# EAGLE design gps_tracker_mark3 (EAGLE 7.4.0)

## Sheet 1 of 2: Flight
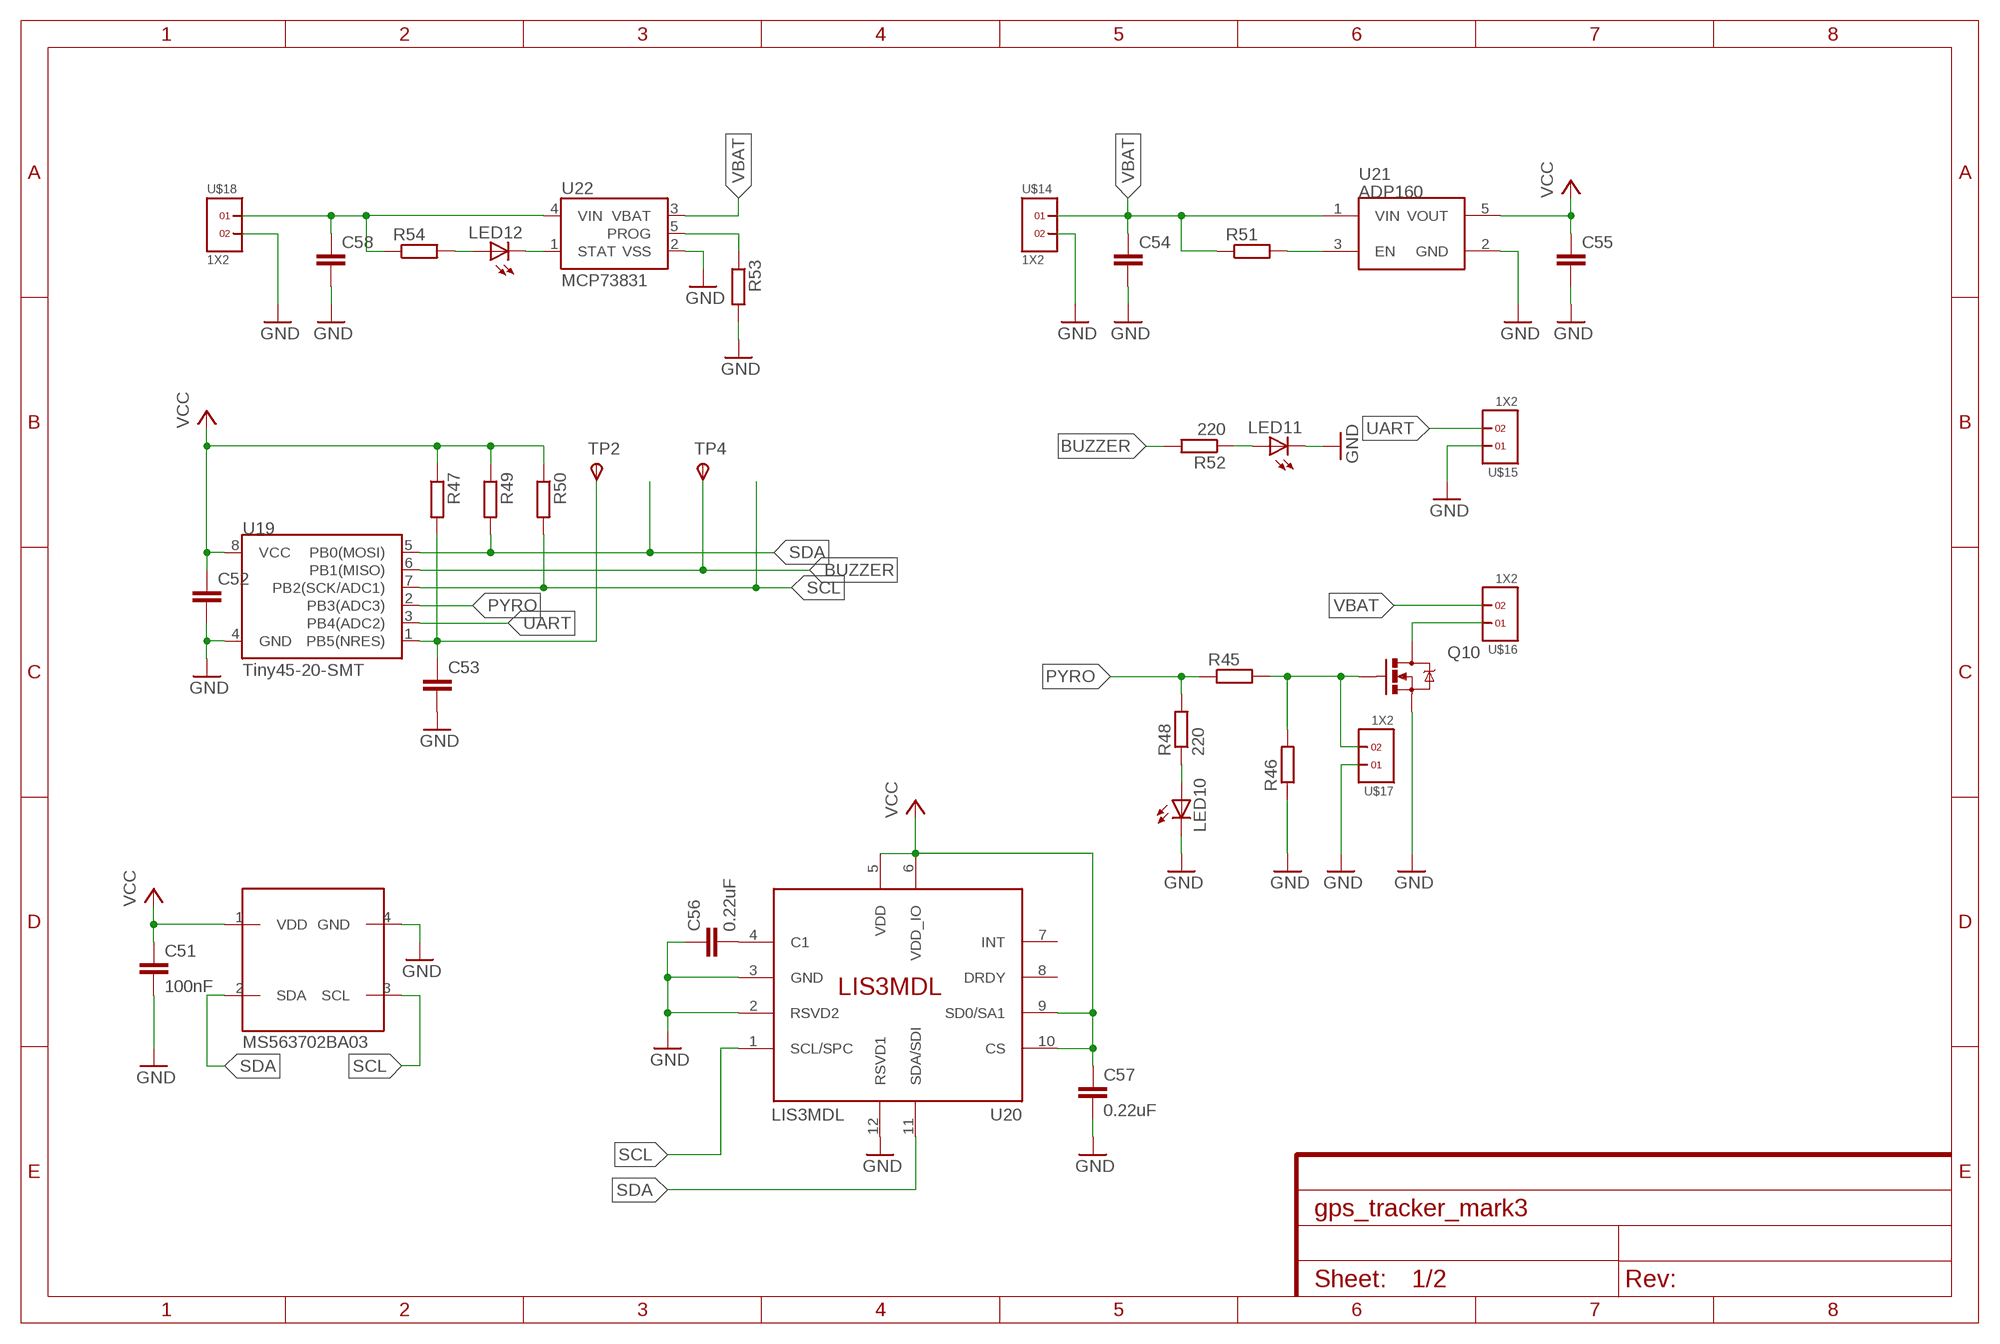
[diagram p0: schematic, sheet 1]

### Parts
C51  100nF  C-EUC0603  [C0603]
C52  C-EUC1206  [C1206]
C53  C-EUC0603  [C0603]
C54  C-EUC0603  [C0603]
C55  C-EUC0603  [C0603]
C56  0.22uF  C-EUC0603K  [C0603K]
C57  0.22uF  C-EUC0603  [C0603]
C58  C-EUC0603  [C0603]
IC2  MS563702BA03  [MS5637]
LED10  LEDCHIPLED_0805  [CHIPLED_0805]
LED11  LEDCHIPLED_0805  [CHIPLED_0805]
LED12  LEDCHIPLED_0603  [CHIPLED_0603]
Q10  MOSFET-NCHANNELBSS123LT1G  [SOT23-3]
R45  R-EU_R0603  [R0603]
R46  R-EU_R0603  [R0603]
R47  R-EU_R0603  [R0603]
R48  220  R-EU_R0603  [R0603]
R49  R-EU_R0603  [R0603]
R50  R-EU_R0603  [R0603]
R51  R-EU_R0603  [R0603]
R52  220  R-EU_R0603  [R0603]
R53  R-EU_R0603  [R0603]
R54  R-EU_R0603  [R0603]
TP2  TPSB1,27  [B1,27]
TP4  TPSB1,27  [B1,27]
U19  Tiny45-20-SMT  ATTINY45TINY45-20-SMT  [SO08-EIAJ]
U20  LIS3MDL  [VFLGA-12]
U21  ADP160  [SOT23-5]
U22  MCP73831  [SOT23-5]
U$14  1X2  [1X2]
U$15  1X2  [1X2]
U$16  1X2  [1X2]
U$17  1X2  [1X2]
U$18  1X2  [1X2]

### Nets
BUZZER: R52.2 TP4.TP(PP) U19.6(PB1(MISO))
GND: C51.2 C52.2 C53.2 C54.2 C55.2 C56.1 C57.2 C58.2 IC2.4(GND) LED10.C LED11.C Q10.2(S) R46.1 R53.2 U19.4(GND) U20.2(RSVD2) U20.3(GND) U20.12(RSVD1) U21.2(GND) U22.2(VSS) U$14.2 U$15.1 U$17.1 U$18.2
N$132: C53.1 R47.2 TP2.TP(PP) U19.1(PB5(NRES))
N$133: Q10.1(G) R45.2 R46.2 U$17.2
N$134: LED10.A R48.1
N$135: C56.2 U20.4(C1)
N$136: R51.2 U21.3(EN)
N$137: LED11.A R52.1
N$138: Q10.3(D) U$16.1
N$139: R53.1 U22.5(PROG)
N$140: LED12.C U22.1(STAT)
N$141: LED12.A R54.2
N$142: C58.1 R54.1 U22.4(VIN) U$18.1
PYRO: R45.1 R48.2 U19.2(PB3(ADC3))
SCL: IC2.3(SCL) R50.2 U19.7(PB2(SCK/ADC1)) U20.1(SCL/SPC)
SDA: IC2.2(SDA) R49.2 U19.5(PB0(MOSI)) U20.11(SDA/SDI)
UART: U19.3(PB4(ADC2)) U$15.2
VBAT: C54.1 R51.1 U21.1(VIN) U22.3(VBAT) U$14.1 U$16.2
VCC: C51.1 C52.1 C55.1 C57.1 IC2.1(VDD) R47.1 R49.1 R50.1 U19.8(VCC) U20.5(VDD) U20.6(VDD_IO) U20.9(SD0/SA1) U20.10(CS) U21.5(VOUT)
Unconnected: U20.7(INT) U20.8(DRDY)

## Sheet 2 of 2: A2235-H
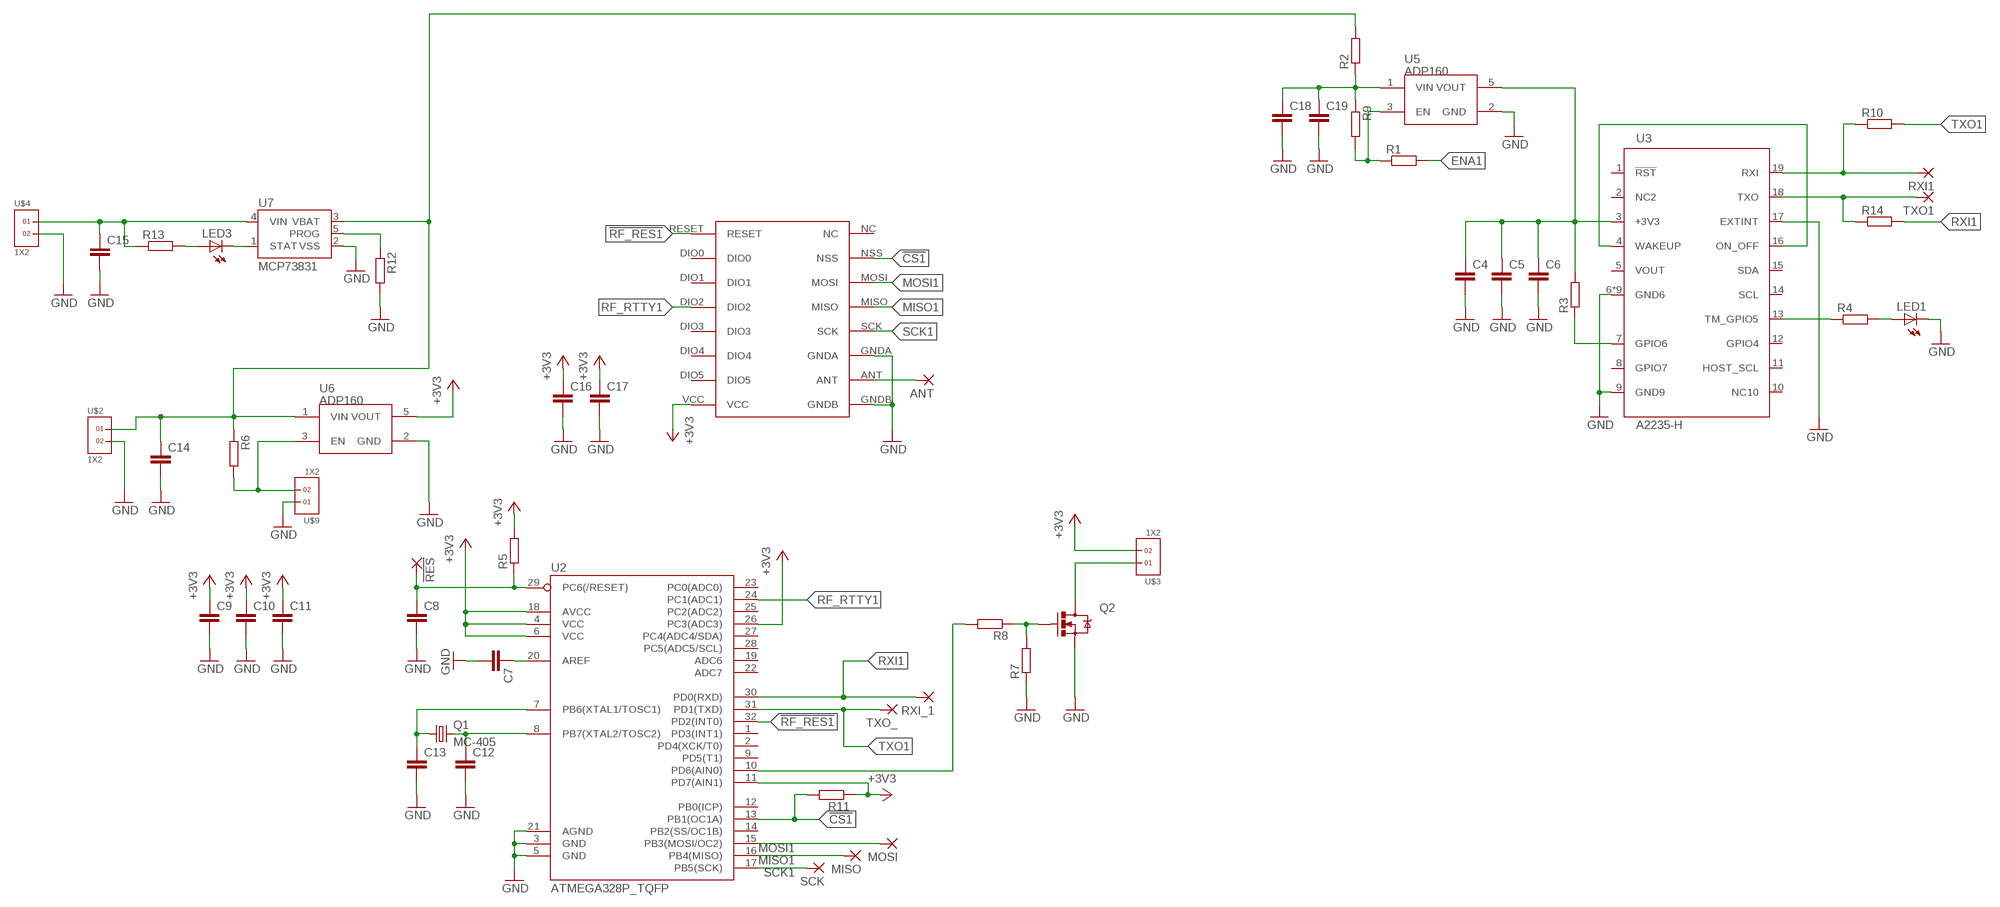
[diagram p1: schematic, sheet 2]

### Parts
!RES  SMD2  [SMD1,27-2,54]
ANT  SMD2  [SMD1,27-2,54]
C4  C-EUC0603  [C0603]
C5  C-EUC0603  [C0603]
C6  C-EUC0603  [C0603]
C7  C-EUC0603  [C0603]
C8  C-EUC0603  [C0603]
C9  C-EUC0603  [C0603]
C10  C-EUC0603  [C0603]
C11  C-EUC0603  [C0603]
C12  C-EUC0603  [C0603]
C13  C-EUC0603  [C0603]
C14  C-EUC0603  [C0603]
C15  C-EUC0603  [C0603]
C16  C-EUC0603  [C0603]
C17  C-EUC0603  [C0603]
C18  C-EUC0603  [C0603]
C19  C-EUC0603  [C0603]
LED1  LEDCHIPLED_0603  [CHIPLED_0603]
LED3  LEDCHIPLED_0603  [CHIPLED_0603]
MISO  SMD2  [SMD1,27-2,54]
MOSI  SMD2  [SMD1,27-2,54]
Q1  MC-405  [MC-405]
Q2  MOSFET-NCHANNELAO3404A  [SOT23-3]
R1  R-EU_R0603  [R0603]
R2  R-EU_R0603  [R0603]
R3  R-EU_R0603  [R0603]
R4  R-EU_R0603  [R0603]
R5  R-EU_R0603  [R0603]
R6  R-EU_R0603  [R0603]
R7  R-EU_R0603  [R0603]
R8  R-EU_R0603  [R0603]
R9  R-EU_R0603  [R0603]
R10  R-EU_R0603  [R0603]
R11  R-EU_R0603  [R0603]
R12  R-EU_R0603  [R0603]
R13  R-EU_R0603  [R0603]
R14  R-EU_R0603  [R0603]
RXI1  SMD2  [SMD1,27-2,54]
RXI_1  SMD2  [SMD1,27-2,54]
SCK  SMD2  [SMD1,27-2,54]
TXO1  SMD2  [SMD1,27-2,54]
TXO_  SMD2  [SMD1,27-2,54]
U2  ATMEGA328P_TQFP  [TQFP32-08]
U3  A2235-H  [A2235-H]
U5  ADP160  [SOT23-5]
U6  ADP160  [SOT23-5]
U7  MCP73831  [SOT23-5]
U$1  RFM69HW  [RFM]
U$2  1X2  [1X2]
U$3  1X2  [1X2]
U$4  1X2  [1X2]
U$9  1X2  [1X2]

### Nets
!CS1: R11.2 U2.13(PB1(OC1A)) U$1.NSS
!RF_RES1: U2.32(PD2(INT0)) U$1.RESET
+3V3_1: C9.1 C10.1 C11.1 C16.1 C17.1 R5.2 R11.1 U2.4(VCC) U2.6(VCC) U2.11(PD7(AIN1)) U2.18(AVCC) U2.26(PC3(ADC3)) U6.5(VOUT) U$1.VCC U$3.2 ; supply symbol labelled +3V3
+BAT1: C14.1 R2.2 R6.1 U6.1(VIN) U7.3(VBAT) U$2.1
ENA1: R1.2 R6.2 U6.3(EN) U$9.2
GND1: C4.2 C5.2 C6.2 C7.2 C8.2 C9.2 C10.2 C11.2 C12.2 C13.2 C14.2 C15.2 C16.2 C17.2 C18.2 C19.2 LED1.C Q2.2(S) R7.1 R12.2 U2.3(GND) U2.5(GND) U2.21(AGND) U3.6(GND6) U3.9(GND9) U3.17(EXTINT) U3.101(GND6) U3.102(GND6) U3.103(GND6) U3.104(GND6) U3.105(GND6) U3.106(GND6) U3.107(GND6) U3.108(GND6) U5.2(GND) U6.2(GND) U7.2(VSS) U$1.GNDA U$1.GNDB U$2.2 U$4.2 U$9.1 ; supply symbol labelled GND
MISO1: MISO.1(P) U2.16(PB4(MISO)) U$1.MISO
MOSI1: MOSI.1(P) U2.15(PB3(MOSI/OC2)) U$1.MOSI
N$2: R1.1 R9.2 U5.3(EN)
N$3: C18.1 C19.1 R2.1 R9.1 U5.1(VIN)
N$6: R3.1 U3.7(GPIO6)
N$7: LED1.A R4.2
N$8: R4.1 U3.13(TM_GPIO5)
N$9: U3.4(WAKEUP) U3.16(ON_OFF)
N$11: R12.1 U7.5(PROG)
N$12: C7.1 U2.20(AREF)
N$13: !RES.1(P) C8.1 R5.1 U2.29(PC6(/RESET))
N$14: ANT.1(P) U$1.ANT
N$15: C12.1 Q1.2 U2.8(PB7(XTAL2/TOSC2))
N$16: C13.1 Q1.1 U2.7(PB6(XTAL1/TOSC1))
N$18: LED3.C U7.1(STAT)
N$19: Q2.1(G) R7.2 R8.1
N$20: R8.2 U2.10(PD6(AIN0))
N$21: Q2.3(D) U$3.1
N$22: LED3.A R13.2
N$24: C15.1 R13.1 U7.4(VIN) U$4.1
N$27: C4.1 C5.1 C6.1 R3.2 U3.3(+3V3) U5.5(VOUT)
RF_RTTY1: U2.24(PC1(ADC1)) U$1.DIO2
RXI1: R14.2 RXI_1.1(P) U2.30(PD0(RXD))
RXI_G1: R10.1 RXI1.1(P) U3.19(RXI)
SCK1: SCK.1(P) U2.17(PB5(SCK)) U$1.SCK
TXO1: R10.2 TXO_.1(P) U2.31(PD1(TXD))
TXO_G1: R14.1 TXO1.1(P) U3.18(TXO)
Unconnected: U2.1(PD3(INT1)) U2.2(PD4(XCK/T0)) U2.9(PD5(T1)) U2.12(PB0(ICP)) U2.14(PB2(SS/OC1B)) U2.19(ADC6) U2.22(ADC7) U2.23(PC0(ADC0)) U2.25(PC2(ADC2)) U2.27(PC4(ADC4/SDA)) U2.28(PC5(ADC5/SCL)) U3.1(!RST) U3.2(NC2) U3.8(GPIO7) U3.10(NC10) U3.11(HOST_SCL) U3.12(GPIO4) U3.14(SCL) U3.15(SDA) U$1.DIO0 U$1.DIO1 U$1.DIO3 U$1.DIO4 U$1.DIO5 U$1.NC

## Power pins joined to a net without a drawn wire
VOUT: U3.5(VOUT)

## Library data of the parts
!RES ANT MISO MOSI RXI1 RXI_1 SCK TXO1 TXO_ = wirepad:SMD2: SMD PAD
C4-C19 C51-C58 = rcl:C-EU: CAPACITOR, European symbol
IC2 = freetronics-original:MS5637
LED1 LED3 LED10-LED12 = led:LED: LED OSRAM: - CHIPLED LG R971, LG N971, LY N971, LG Q971, LY Q971, LO R971, LY R971 LH N974, LH R974 LS Q976, LO Q976, LY Q976 LO Q996 - Hyper CHIPLED LW Q18S LB Q993, LB Q99A, LB R99A - SideLED LS A670, LO A670, LY A670, LG A670, LP A670 LB A673, LV A673, LT A673, LW A673 LH A674 LY A675 LS A676, LA A676, LO A676, LY A676, LW A676 LS A679, LY A679, LG A679 - Hyper Micro SIDELED® LS Y876, LA Y876, LO Y876, LY Y876 LT Y87S - SmartLED LW L88C, LW L88S LB L89C, LB L89S, LG L890 LS L89K, LO L89K, LY L89K LS L896, LA L896, LO L896, LY L896 - TOPLED LS T670, LO T670, LY T670, LG T670, LP T670 LSG T670, LSP T670, LSY T670, LOP T670, LYG T670 LG T671, LOG T671, LSG T671 LB T673, LV T673, LT T673, LW T673 LH T674 LS T676, LA T676, LO T676, LY T676, LB T676, LH T676, LSB T676, LW T676 LB T67C, LV T67C, LT T67C, LS T67K, LO T67K, LY T67K, LW E67C LS E67B, LA E67B, LO E67B, LY E67B, LB E67C, LV E67C, LT E67C LW T67C LS T679, LY T679, LG T679 LS T770, LO T770, LY T770, LG T770, LP T770 LB T773, LV T773, LT T773, LW T773 LH T774 LS E675, LA E675, LY E675, LS T675 LS T776, LA T776, LO T776, LY T776, LB T776 LHGB T686 LT T68C, LB T68C - Hyper Mini TOPLED® LB M676 - Mini TOPLED Santana® LG M470 LS M47K, LO M47K, LY M47K Source: http://www.osram.convergy.de LUXEON: - LUMILED® LXK2-PW12-R00, LXK2-PW12-S00, LXK2-PW14-U00, LXK2-PW14-V00 LXK2-PM12-R00, LXK2-PM12-S00, LXK2-PM14-U00 LXK2-PE12-Q00, LXK2-PE12-R00, LXK2-PE12-S00, LXK2-PE14-T00, LXK2-PE14-U00 LXK2-PB12-K00, LXK2-PB12-L00, LXK2-PB12-M00, LXK2-PB14-N00, LXK2-PB14-P00, LXK2-PB14-Q00 LXK2-PR12-L00, LXK2-PR12-M00, LXK2-PR14-Q00, LXK2-PR14-R00 LXK2-PD12-Q00, LXK2-PD12-R00, LXK2-PD12-S00 LXK2-PH12-R00, LXK2-PH12-S00 LXK2-PL12-P00, LXK2-PL12-Q00, LXK2-PL12-R00 Source: www.luxeon.com KINGBRIGHT: KA-3528ASYC Source: www.kingbright.com
Q1 = gps_tracker:MC-405: kHz RANGE CRYSTAL UNIT SMD Source: MC-306_405_406_E07X.PDF Homepage <http://www.epsontoyocom.co.jp>; FARNELL: 2508596; OC_FARNELL: unknown; OC_NEWARK: unknown
Q2 = SparkFun-DiscreteSemi:MOSFET-NCHANNEL: Common NMOSFET Parts MFG P/N Store ID Prod ID FDD8780 TRANS-09984 SI7820DN TRANS-11055 FDS6630A IC-08089 2N7002PW TRANS-11151 FQP30N06L COM-10213 TRANS-10060 BSS123LT1G TRANS-08345 BSS138 TRANS-00830 BS170 2N7000; PROD_ID: TRAN-12988
Q10 = SparkFun-DiscreteSemi:MOSFET-NCHANNEL: Common NMOSFET Parts MFG P/N Store ID Prod ID FDD8780 TRANS-09984 SI7820DN TRANS-11055 FDS6630A IC-08089 2N7002PW TRANS-11151 FQP30N06L COM-10213 TRANS-10060 BSS123LT1G TRANS-08345 BSS138 TRANS-00830 BS170 2N7000; PROD_ID: TRANS-08345
R1-R14 R45-R47 R49-R51 R53 R54 = rcl:R-EU_: RESISTOR, European symbol
R48 R52 = resistor:R-EU_: RESISTOR, European symbol
TP2 TP4 = testpad:TPS: TEST PIN
U2 = SparkFun-DigitalIC:ATMEGA328P_TQFP; PROD_ID: IC-09069
U3 = gps_tracker:A2235-H
U5 U6 U21 = SparkFun-PowerIC:ADP160: Nanopower LDO Iq less than 1uA for low Iload; FARNELL: 2510377; PROD_ID: VREG-11306
U7 U22 = SparkFun-PowerIC:MCP73831: Miniature single cell, fully integrated Li-Ion, Li-polymer charge management controller http://ww1.microchip.com/downloads/en/DeviceDoc/20001984g.pdf IC-09995; FARNELL: 1834892; PROD_ID: IC-09995
U19 = SparkFun-DigitalIC:ATTINY45: Atmel 8-pin 2/4/8kB flash uC; PROD_ID: IC-08922
U20 = kg-ic:LIS3MDL: Digital output magnetic sensor: ultra-low-power high-performance 3-axis magnetometer The LIS3MDL is an ultra-low-power high-performance three-axis Magnetic Sensor. It has user-selectable full scales of ±4/ ±8/ ±12/ ±16 gauss. The self-test capability allows the user to check the functioning of the sensor in the final application. The device may be configured to generate interrupt signals for magnetic field detection. It includes an I²C serial bus interface that supports standard and fast mode (100 and 400kHz) and SPI serial standard interface. Independent IO Supply (1.8V) ±4/±8/±12/±16 Gauss Selectable Magnetic Full Scale Continuous and Single-conversion Modes 16-bit Data Output Interrupt Generator Self-test I²C/SPI Digital Output Interface Power-down Mode/Low-power Mode
U$1 = hoperf:RFM69HW
U$2-U$4 U$9 U$14-U$18 = headers(2mm)(samtec):1X2

## Board
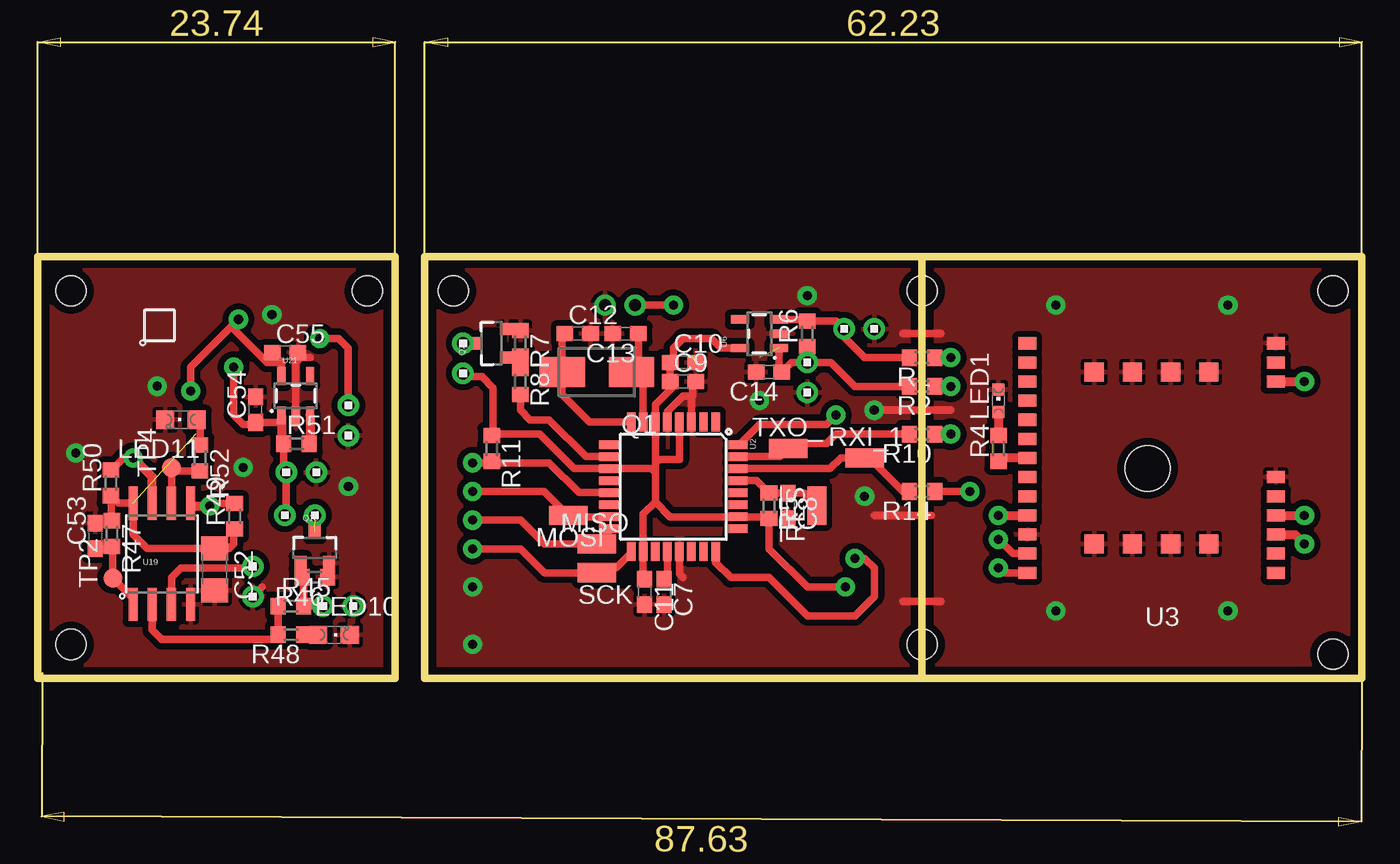
[diagram p2: board, top side]
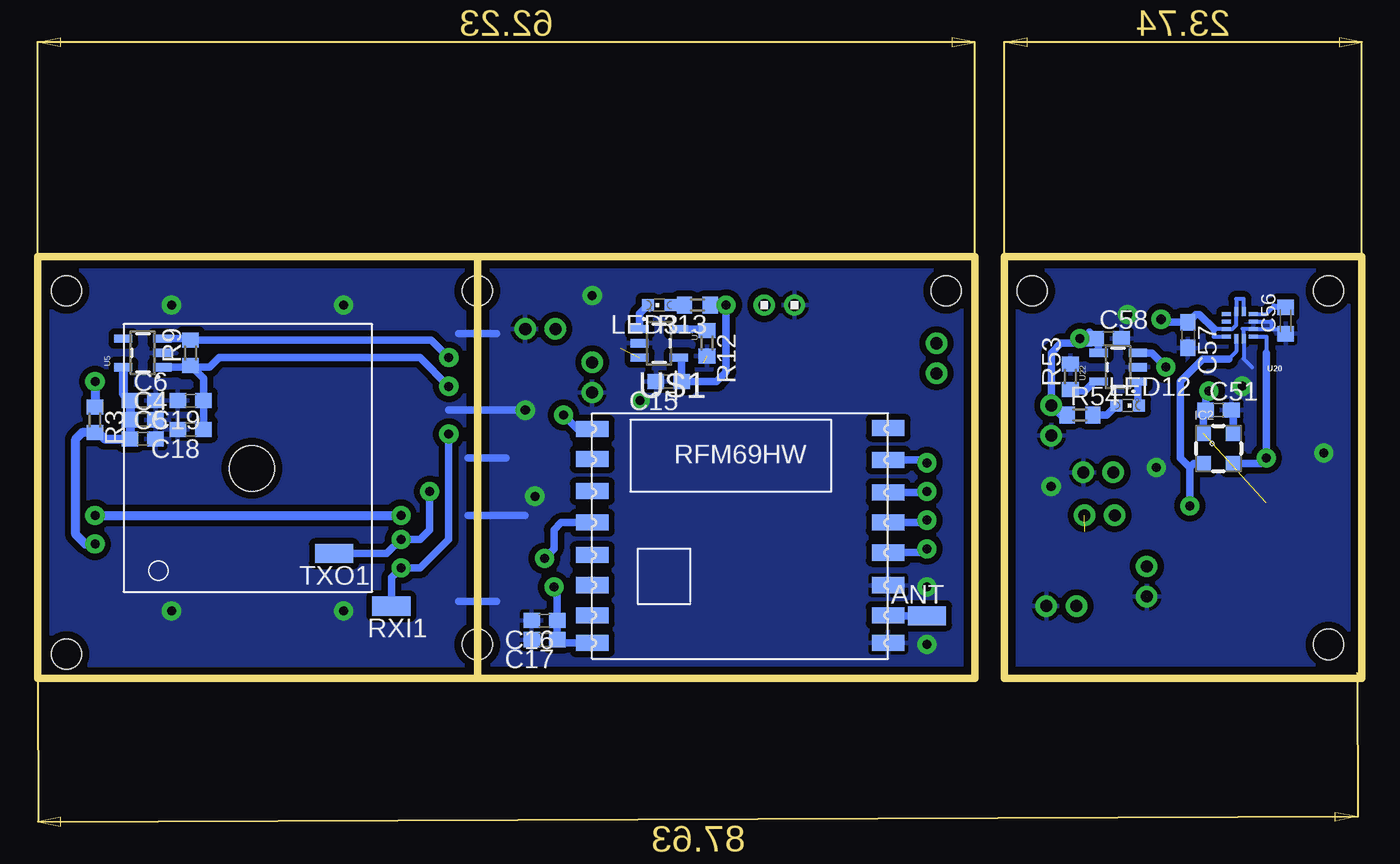
[diagram p3: board, bottom side, seen from below]

Size 87.94 x 28 mm. Coordinates in mm from the lower left corner, seen from the top.
Outline: 58.73,28 25.71,28 25.71,0 58.73,0
Outline: 58.73,28 58.73,0
Outline: 58.73,28 87.94,28 87.94,0 58.73,0
Outline: 0,0 23.74,0 23.74,28 0,28 0,0
Copper layers (1*16): Top 0.035mm / dielectric 12.5mil / Bottom 0.035mm
Design rules "default *": minimum track width 10mil, minimum drill 24mil, track to track 8mil, track to pad 8mil, pad to pad 8mil, via to via 8mil, smd to smd 8mil, copper to edge 20mil, drill to drill 8mil, minimum pad ring 10mil, minimum via ring 8mil, stop-mask expansion 4mil, vias tented up to drill 0mil, thermal gap 10mil
Holes 2 mm at 2.21,2.25 2.21,25.75 21.9,25.75 27.61,25.75 86.03,25.75 58.73,2.25 58.73,25.75 86.03,1.62
tRestrict: area 29.5,22.3 to 30.8,22.9; area 35.9,21 to 38.4,21.6; area 38.4,24.2 to 39,24.8; area 38.4,6.4 to 39.7,7
bRestrict: area 8.3,14 to 10.8,16.5

### Footprints (pad centres in the part's own frame; a part is rotated, then mirrored left to right if it is on the bottom)
SMD1,27-2,54 = smd 1.27 x 2.54: 1 0,0
C0603 = smd 1.1 x 1: 1 -0.85,0; 2 0.85,0
C1206 = smd 1.6 x 1.8: 1 -1.4,0; 2 1.4,0
C0603K = smd 1.05 x 1.08: 1 -0.875,0; 2 0.875,0
MS5637 = smd 1 x 1: 1 -1,1; 2 -1,-1; 3 1,-1; 4 1,1
CHIPLED_0603 = smd 0.8 x 0.8: A 0,-0.75; C 0,0.75
CHIPLED_0805 = smd 1.2 x 1.2: A 0,-1.05; C 0,1.05
MC-405 = smd 3 x 2: 1 -2.3,0; 2 2.3,0
SOT23-3 = smd 0.8 x 0.9: 1 -0.95,-1; 2 0.95,-1; 3 0,1.1
R0603 = smd 1 x 1.1: 1 -0.85,0; 2 0.85,0
B1,27 = smd 1.27 x 1.27: TP 0,0
TQFP32-08 = smd 1.27 x 0.559: 1 -4.293,2.8; 2 -4.293,2; 3 -4.293,1.2; 4 -4.293,0.4; 5 -4.293,-0.4; 6 -4.293,-1.2; 7 -4.293,-2; 8 -4.293,-2.8; 17 4.293,-2.8; 18 4.293,-2; 19 4.293,-1.2; 20 4.293,-0.4; 21 4.293,0.4; 22 4.293,1.2; 23 4.293,2; 24 4.293,2.8 | smd 0.559 x 1.27: 9 -2.8,-4.293; 10 -2,-4.293; 11 -1.2,-4.293; 12 -0.4,-4.293; 13 0.4,-4.293; 14 1.2,-4.293; 15 2,-4.293; 16 2.8,-4.293; 25 2.8,4.293; 26 2,4.293; 27 1.2,4.293; 28 0.4,4.293; 29 -0.4,4.293; 30 -1.2,4.293; 31 -2,4.293; 32 -2.8,4.293
A2235-H = smd 1.2 x 0.8: 1 -8.255,7.62; 2 -8.255,6.35; 3 -8.255,5.08; 4 -8.255,3.81; 5 -8.255,2.54; 6 -8.255,1.27; 7 -8.255,-5.08; 8 -8.255,-6.35; 9 -8.255,-7.62; 10 8.255,-3.81; 11 8.255,-2.54; 12 8.255,-1.27; 13 8.255,0; 14 8.255,1.27; 15 8.255,2.54; 16 8.255,3.81; 17 8.255,5.08; 18 8.255,6.35; 19 8.255,7.62; 201 8.255,-5.08; 202 8.255,-6.35; 203 8.255,-7.62 | smd 1.27 x 1.27: 101 1.27,-5.715; 102 -3.81,-5.715; 103 -3.81,5.715; 104 -1.27,-5.715; 105 -1.27,5.715; 106 3.81,-5.715; 107 3.81,5.715; 108 1.27,5.715 | hole 3: 0.255,0.69
SOT23-5 = smd 0.55 x 1.2: 1 -0.95,-1.3; 2 0,-1.3; 3 0.95,-1.3; 4 0.95,1.3; 5 -0.95,1.3
SO08-EIAJ = smd 0.61 x 2.21: 1 -1.905,-3.378; 2 -0.635,-3.378; 3 0.635,-3.378; 4 1.905,-3.378; 5 1.905,3.353; 6 0.635,3.353; 7 -0.635,3.353; 8 -1.905,3.353
VFLGA-12 = smd 0.6 x 0.25: 1 -0.9,0.75; 2 -0.9,0.25; 3 -0.9,-0.25; 4 -0.9,-0.75; 7 0.9,-0.75; 8 0.9,-0.25; 9 0.9,0.25; 10 0.9,0.75 | smd 0.25 x 0.6: 5 -0.25,-0.9; 6 0.25,-0.9; 11 0.25,0.9; 12 -0.25,0.9
RFM = smd 2.184 x 1.067: ANT 9.491,-4.731; DIO0 -10.16,5.65; DIO1 -10.16,3.522; DIO2 -10.16,1.427; DIO3 -10.16,-0.731; DIO4 -10.16,-2.731; DIO5 -10.16,-4.731; GNDA 9.491,-2.731; GNDB 9.491,-6.572; MISO 9.491,1.427; MOSI 9.491,3.428; NC 9.491,7.714; NSS 9.491,5.586; RESET -10.16,7.65; SCK 9.491,-0.573; VCC -10.16,-6.572
1X2 = drill 0.8 pad 1.422: 1 0,0; 2 2,0

### Placement (x,y rotation side)
!RES  51.74,11.46 0 top
ANT  28.88,4.16 270 bottom
C4  80.95,17.18 0 bottom
C5  80.95,15.91 0 bottom
C6  80.95,18.45 0 bottom
C7  41.58,5.75 270 top
C8  49.84,11.46 270 top
C9  42.85,19.72 0 top
C10  42.85,20.98 0 top
C11  40.31,5.75 270 top
C12  35.87,22.89 0 top
C13  39.04,22.89 180 top
C14  48.57,20.35 180 top
C15  46.03,19.72 180 bottom
C16  54.28,3.84 180 bottom
C17  54.28,2.57 180 bottom
C18  77.78,16.54 180 bottom
C19  77.78,18.45 180 bottom
C51  9.52,17.81 0 bottom
C52  11.76,7.24 270 top
C53  3.84,9.46 90 top
C54  14.47,17.84 90 top
C55  16.43,21.63 0 top
C56  5.06,23.76 90 bottom
C57  11.55,22.8 270 bottom
C58  16.82,22.57 0 bottom
IC2  9.52,15.27 0 bottom
LED1  63.81,18.45 0 top
LED3  46.66,24.8 90 bottom
LED10  19.68,2.89 270 top
LED11  9.52,17.18 90 top
LED12  15.55,18.13 270 bottom
MISO  37.14,8.92 270 top
MOSI  35.23,10.83 90 top
Q1  37.14,20.35 180 top
Q2  30.15,22.26 90 top
Q10  18.4,8.67 0 top
R1  58.73,21.3 180 top
R2  58.73,19.4 180 top
R3  84.13,17.18 270 bottom
R4  63.81,15.27 90 top
R5  48.57,11.46 270 top
R6  51.11,22.89 90 top
R7  32.06,22.26 270 top
R8  32.06,19.72 270 top
R9  77.78,21.62 90 bottom
R10  58.73,16.22 180 top
R11  30.15,15.27 270 top
R12  43.49,22.26 270 bottom
R13  44.12,24.8 180 bottom
R14  58.73,12.41 180 top
R45  16.83,4.8 0 top
R46  18.4,6.72 180 top
R47  4.94,9.62 270 top
R48  16.82,2.9 180 top
R49  13.09,10.76 90 top
R50  4.87,12.98 90 top
R51  17.19,15.58 0 top
R52  10.79,14.64 270 top
R53  19.36,20.03 90 bottom
R54  18.72,17.49 0 bottom
RXI1  64.44,4.79 90 bottom
RXI_1  54.92,14.63 270 top
SCK  37.14,7.02 90 top
TP2  5,6.66 90 top
TP4  8.89,14 90 top
TXO1  68.25,8.29 90 bottom
TXO_  49.84,15.27 270 top
U2  42.22,12.73 270 top
U3  73.97,14.64 180 top
U5  80.95,21.62 90 bottom
U6  47.93,22.89 90 top
U7  46.66,22.26 270 bottom
U19  8.25,8.29 0 top
U20  8.1,23.45 180 bottom
U21  17.14,18.77 0 top
U22  16.18,20.67 90 bottom
U$1  40.95,8.92 0 bottom
U$2  51.11,20.98 270 top
U$3  28.25,22.26 270 top
U$4  39.68,24.8 0 bottom
U$9  55.55,23.21 180 top
U$14  16.51,13.69 0 top
U$15  14.28,5.43 90 top
U$16  18.41,10.83 180 top
U$17  20.95,4.8 180 top
U$18  20.63,18.13 270 top

### Tracks (layer width: path | path; a pad name or v marks a point on that pad's centre or on a via)
!CS1  (via drill 0.6 pad 1.27)
  Top 0.5: U2.13 35.95,12.33 33.96,14.32 30.26,14.32 R11.2 30.05,14.32 v28.88,14.32
  Bottom 0.5: U$1.NSS 28.7,14.51 v28.88,14.32
!RF_RES1  (via drill 0.6 pad 1.27)
  Top 0.5: v53.01,17.49 52.38,16.86 47.93,16.86 46.61,15.53 U2.32
  Bottom 0.5: U$1.RESET 52.09,16.57 v53.01,17.49
+3V3_1  (via drill 0.6 pad 1.27)
  Top 0.5: v53.65,6.06 51.11,6.06 48.57,8.6 R5.2 48.45,10.73 U2.26 42,10.73 41.02,11.71 | C11.1 40.22,6.69 U2.18 40.22,10.91 41.02,11.71 | 41.02,14.32 U2.6 41.02,18.2 42.22,19.4 42.22,19.5 C9.1 | 41.02,14.32 41.02,13.68 | 41.02,13.68 41.02,11.71 | 41.02,13.68 40.77,13.93 U2.11 35.62,13.93 33.33,16.22 30.26,16.22 | U2.4 42.62,14.55 41.25,14.55 41.02,14.32 | 30.26,16.22 R11.1 | U6.5 45.39,21.94 44.76,22.57 42.85,22.57 42.22,21.94 42.22,21.2 C10.1 C9.1 | C9.1 41.9,19.72 | 30.26,16.22 30.26,19.3 29.52,20.03 28.47,20.03 U$3.2
  Bottom 0.5: U$1.VCC 53.21,2.35 C17.1 C16.1 53.43,5.85 v53.65,6.06
+BAT1  (1 unrouted)
  Top 0.5: U$2.1 R6.1 | U6.1 49.23,20.54 C14.1 50.05,20.99 U$2.1 | R2.2 54.28,19.4 52.7,20.99 U$2.1
BUZZER
  Top 0.5: U19.6 TP4.TP 9.1,13.79 R52.2
ENA1
  Top 0.5: U6.3 51.01,23.84 R6.2 53.02,23.74 U$9.2 53.65,23.11 53.65,22.57 54.92,21.3 R1.2
GND  (via drill 0.6 pad 1.27)  (1 unrouted)
  Top 0.5: U$15.1 14.91,6.06 | U21.2 17.14,20.99 17.45,21.3 17.61,21.3 | 17.61,21.3 C55.2 | 17.61,21.3 18.09,21.3
  Bottom 0.25: 5.37,23.2 C56.1 | U20.3 6.02,23.7 6.02,23.2 | 6.02,23.2 U20.2 7.92,23.2 7.85,23.12 U20.12 7.85,21.22 7.29,20.67 | 6.02,23.2 5.39,23.2 5.39,23.21
  Bottom 0.5: IC2.4 8.52,17.66 C51.2
  other vias: 2.54,14.96 7.93,19.4 13.65,14 20.64,12.73 15.56,24.16
  pour Top (isolate 0.406): -0.32,28.58 24.21,28.58 24.21,-0.33 -0.32,-0.33
  pour Bottom (isolate 0.406): 0,-0.28 24.44,-0.6 24.44,28.61 0,28.29
GND1  (via drill 0.6 pad 1.27)  (1 unrouted)
  Top 0.5: U2.21 42.62,6.93 42.85,6.7 | Q2.2 31.96,23.21 R7.1 | U2.5 41.82,17.73 42.85,18.76 43.49,18.76 | 43.49,18.76 43.49,19.5 C9.2 | U2.3 43.42,18.69 43.49,18.76 | 60,5.11 57.46,5.11 | 60.63,17.81 v55.55,17.81 | 60,22.89 57.46,22.89 | 59.36,10.83 55.55,10.83
  Bottom 0.5: 60,5.11 57.46,5.11 | 60.63,17.81 v55.55,17.81 | 60,22.89 57.46,22.89 | 59.36,10.83 55.55,10.83 | 59.36,14.64 56.82,14.64
  other vias: 28.88,6.06 28.88,2.25 47.93,18.45 54.92,12.09 79.05,24.8 67.62,24.8 67.62,4.48 79.05,4.48 51.11,25.43
  pour Bottom (isolate 0.406): 87.94,-1.24 87.94,29.24 24.44,29.24 24.44,-1.24
  pour Top (isolate 0.406): 87.94,-1.24 87.94,29.24 24.44,29.24 24.44,-1.24
MISO1  (via drill 0.6 pad 1.27)
  Top 0.5: U2.16 37.93,9.71 MISO.1 33.65,8.92 32.06,10.51 v28.88,10.51
  Bottom 0.5: U$1.MISO 29.04,10.35 v28.88,10.51
MOSI1  (via drill 0.6 pad 1.27)
  Top 0.5: U2.15 35.33,10.73 MOSI.1 33.65,12.41 v28.88,12.41
  Bottom 0.5: U$1.MOSI 28.95,12.35 v28.88,12.41
N$2  (via drill 0.6 pad 1.27)
  Top 0.5: v60.63,21.3 R1.1
  Bottom 0.5: U5.3 77.88,22.57 R9.2 61.8,22.47 v60.63,21.3
N$3  (via drill 0.6 pad 1.27)
  Top 0.5: R2.1 v60.63,19.4
  Bottom 0.5: C18.1 C19.1 76.93,19.92 R9.1 | U5.1 77.88,20.67 R9.1 | v60.63,19.4 62.54,21.3 75.87,21.3 76.51,20.67 77.68,20.67 R9.1
N$6  (via drill 0.6 pad 1.27)
  Top 0.61: U3.7 v84.13,19.72
  Bottom 0.61: v84.13,19.72 R3.1
N$7
  Top 0.61: LED1.A R4.2
N$8
  Top 0.61: U3.13 64.02,14.64 R4.1
N$9  (via drill 0.6 pad 1.27)
  Top 0.61: U3.4 v84.13,10.83 | v63.81,10.83 U3.16
  Bottom 0.61: v84.13,10.83 v63.81,10.83
N$11
  Bottom 0.5: U7.5 43.59,23.21 R12.1
N$12
  Top 0.5: U2.20 41.82,6.83 C7.1
N$13
  Top 0.5: U2.29 47.75,13.13 R5.1 C8.1 50.89,12.31 !RES.1
N$14
  Bottom 0.5: ANT.1 31.43,4.16 U$1.ANT
N$15
  Top 0.5: U2.8 36.66,17.02 34.84,18.84 Q1.2 34.84,22.71 C12.1
N$16
  Top 0.5: U2.7 40.22,19.57 Q1.1 39.89,20.81 C13.1
N$18
  Bottom 0.5: U7.1 47.96,24.25 LED3.C
N$19
  Top 0.5: Q2.1 31.96,21.31 R7.2 R8.1
N$20
  Top 0.5: U2.10 36.41,14.73 33.96,17.18 32.69,17.18 32.06,17.81 R8.2
N$21
  Top 0.5: U$3.1 Q2.3
N$22
  Bottom 0.5: LED3.A R13.2
N$24  (via drill 0.6 pad 1.27)
  Top 0.5: U$4.1 v42.22,24.8
  Bottom 0.5: U7.4 45.18,21.12 C15.1 42.85,19.72 42.22,20.35 v42.22,24.8 R13.1
N$27  (via drill 0.6 pad 1.27)
  Top 0.61: U3.3 83.49,9.56 v84.13,8.92
  Bottom 0.61: U5.5 82.25,18.9 C6.1 C4.1 C5.1 83.49,15.91 83.91,16.33 R3.2 84.98,16.33 85.4,15.91 85.4,9.56 84.76,8.92 v84.13,8.92
N$132
  Top 0.5: C53.1 4.94,8.61 R47.2 5,8.72 TP2.TP 6.35,5.31 U19.1
N$133
  Top 0.5: U$17.2 R45.2 17.68,6.6 R46.2
  Top 0.61: Q10.1 17.45,6.82 R46.2
N$134
  Top 0.5: R48.1 LED10.A
N$135
  Bottom 0.25: U20.4 6.35,24.2 5.85,24.7
  Bottom 0.406: 5.85,24.7 5.12,24.7 C56.2
N$136
  Top 0.61: U21.3 18.09,15.64 R51.2
N$137
  Top 0.5: R52.1 10.79,16.96 LED11.A
N$138  (1 unrouted)
N$139
  Bottom 0.5: U22.5 17.77,19.72 18.41,19.08 19.26,19.08 R53.1
N$140
  Bottom 0.5: U22.1 14.88,18.21 LED12.C
N$141
  Bottom 0.5: R54.2 16.93,17.49 LED12.A
N$142  (via drill 0.6 pad 1.27)
  Top 0.5: U$18.1 20.63,21.94 19.99,22.57 v18.72,22.57
  Bottom 0.5: U22.4 17.48,22.39 C58.1 | R54.1 19.99,17.49 U$18.1 20.63,21.62 19.99,22.26 17.99,22.26 C58.1 | 18.09,22.99 C58.1
PYRO
  Top 0.5: 15.87,2.8 R48.2 | R48.2 R45.1 | U19.2 7.62,3.21 8.25,2.57 15.65,2.57 R48.2
RF_RTTY1  (via drill 0.6 pad 1.27)
  Top 0.5: v54.28,7.97 54.92,7.97 55.55,7.33 55.55,5.43 54.28,4.16 51.11,4.16 48.57,6.7 46.03,6.7 45.02,7.71 U2.24
  Bottom 0.5: U$1.DIO2 53.17,10.35 53.65,9.87 53.65,8.6 v54.28,7.97
RXI1
  Top 0.5: U2.30 52.63,13.93 53.33,14.63 RXI_1.1 55.24,14.32 55.55,14.32 57.46,12.41 R14.2
RXI_G1  (via drill 0.6 pad 1.27)
  Top 0.5: R10.1 v60.63,16.22 | U3.19 64.13,7.02 v63.81,7.33
  Bottom 0.5: v60.63,16.22 60.63,9.24 62.54,7.33 v63.81,7.33 64.44,6.7 RXI1.1
SCK1  (via drill 0.6 pad 1.27)
  Top 0.5: U2.17 39.42,8.34 38.41,7.33 37.46,7.33 SCK.1 33.65,7.02 32.06,8.6 v28.88,8.6
  Bottom 0.5: U$1.SCK 29.14,8.35 v28.88,8.6
SCL  (via drill 0.6 pad 1.27)
  Top 0.5: R50.2 4.91,13.83 5.71,14.64 v6.35,14.64
  Top 0.61: U19.7 7.62,13.37 v6.35,14.64
  Bottom 0.25: U20.1 6.35,22.7 6.35,21.62
  Bottom 0.5: IC2.3 6.71,14.27 v6.35,14.64 6.35,21.62
SDA  (via drill 0.6 pad 1.27)
  Top 0.3: 10.26,11.46 U19.5
  Top 0.5: R49.2 11.57,11.61 v11.43,11.46
  Top 0.61: 10.26,11.46 v11.43,11.46
  Bottom 0.25: U20.11 8.35,21.7 8.85,21.2
  Bottom 0.5: IC2.2 11.16,14.27 11.43,14 | 11.43,14 v11.43,11.46 | 8.85,21.2 10.58,21.2 12.06,19.72 12.06,14.64 11.43,14
TXO1
  Top 0.5: U2.31 49.3,14.73 TXO_.1 50.16,15.59 52.38,15.59 53.01,16.22 R10.2
TXO_G1  (via drill 0.6 pad 1.27)
  Top 0.5: U3.18 64.76,8.29 v63.81,9.24 | R14.1 v61.9,12.41
  Bottom 0.5: v61.9,12.41 61.9,9.87 62.54,9.24 v63.81,9.24 64.76,8.29 TXO1.1
UART
  Top 0.5: U19.3 8.89,6.7 9.2,7.02 | 9.2,7.02 | 9.2,7.02 9.52,7.34 13.87,7.34 U$15.2
VBAT  (via drill 0.6 pad 1.27)
  Top 0.5: R51.1 16.34,13.86 U$14.1 16.51,10.92 U$16.2 | 16.19,16.86 16.06,16.99 C54.1 14.33,16.86 13.64,16.86 13.01,17.49 v13.01,20.67
  Top 0.61: U21.1 16.19,16.86 16.19,15.73 R51.1
  Bottom 0.5: U22.3 13.96,21.62 v13.01,20.67
VCC  (via drill 0.6 pad 1.27)  (1 unrouted)
  Top 0.5: R49.1 13.02,9.84 13.02,8.92 12.73,8.64 C52.1 7.27,8.64 6.35,9.56 U19.8 5.36,11.64 R50.1 4.87,10.47 R47.1 | U21.5 16.19,20.97 16.21,20.99 | 16.21,20.99 C55.1 | v10.16,19.08 10.16,20.67 12.85,23.37 | 12.85,23.37 v13.33,23.85 | 16.21,20.99 15.23,20.99 12.85,23.37
  Bottom 0.25: U20.5 7.85,25.2 8.35,25.2 U20.6 8.35,23.45 8.6,23.2 U20.9 9.85,23.2 9.85,22.7 U20.10
  Bottom 0.5: IC2.1 10.52,17.66 C51.1 10.37,18.87 v10.16,19.08 | 9.85,23.2 9.85,23.22 10.79,24.16 11.04,24.16 C57.1 13.13,23.65 v13.33,23.85